# Altium schematic sheet USB.SchDoc
size A4
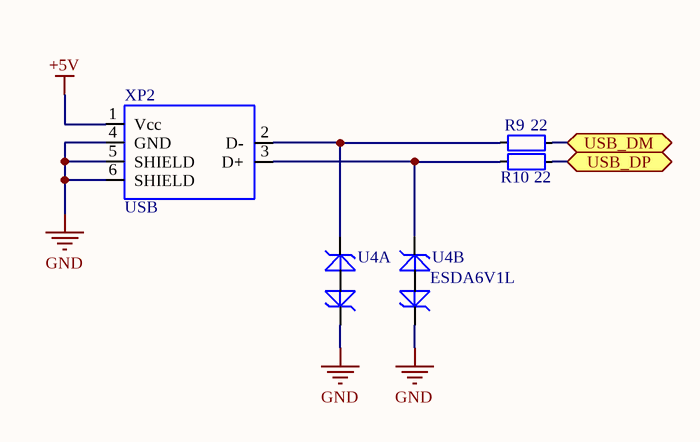
[diagram p0: USB.SchDoc]

## Parts
R9  22  [SMD_0805]
R10  22  [SMD_0805]
U4  ESDA6V1L  [SOT23-3]  (value not drawn)  (parts A,B of 2)
XP2  USB  [USB/SM2.5-4H4]

## Ports
USB_DM (bidir), USB_DP (bidir)

## Nets
+5V: XP2.1(Vcc)
GND: U4.3 XP2.4(GND) XP2.5(SHIELD) XP2.6(SHIELD)
USB_DM: R9.1 ; port USB_DM
USB_DP: R10.1 ; port USB_DP
NetR9_2: R9.2 U4.1 XP2.2(D-)
NetR10_2: R10.2 U4.2 XP2.3(D+)

## Library data of the parts
R9 R10 = RES: Resistor; Value: 22; Case: *
U4 = CDSOT23-SM712: Value: ESDA6V1L